# Altium schematic sheet SAMD51.SchDoc
size A3
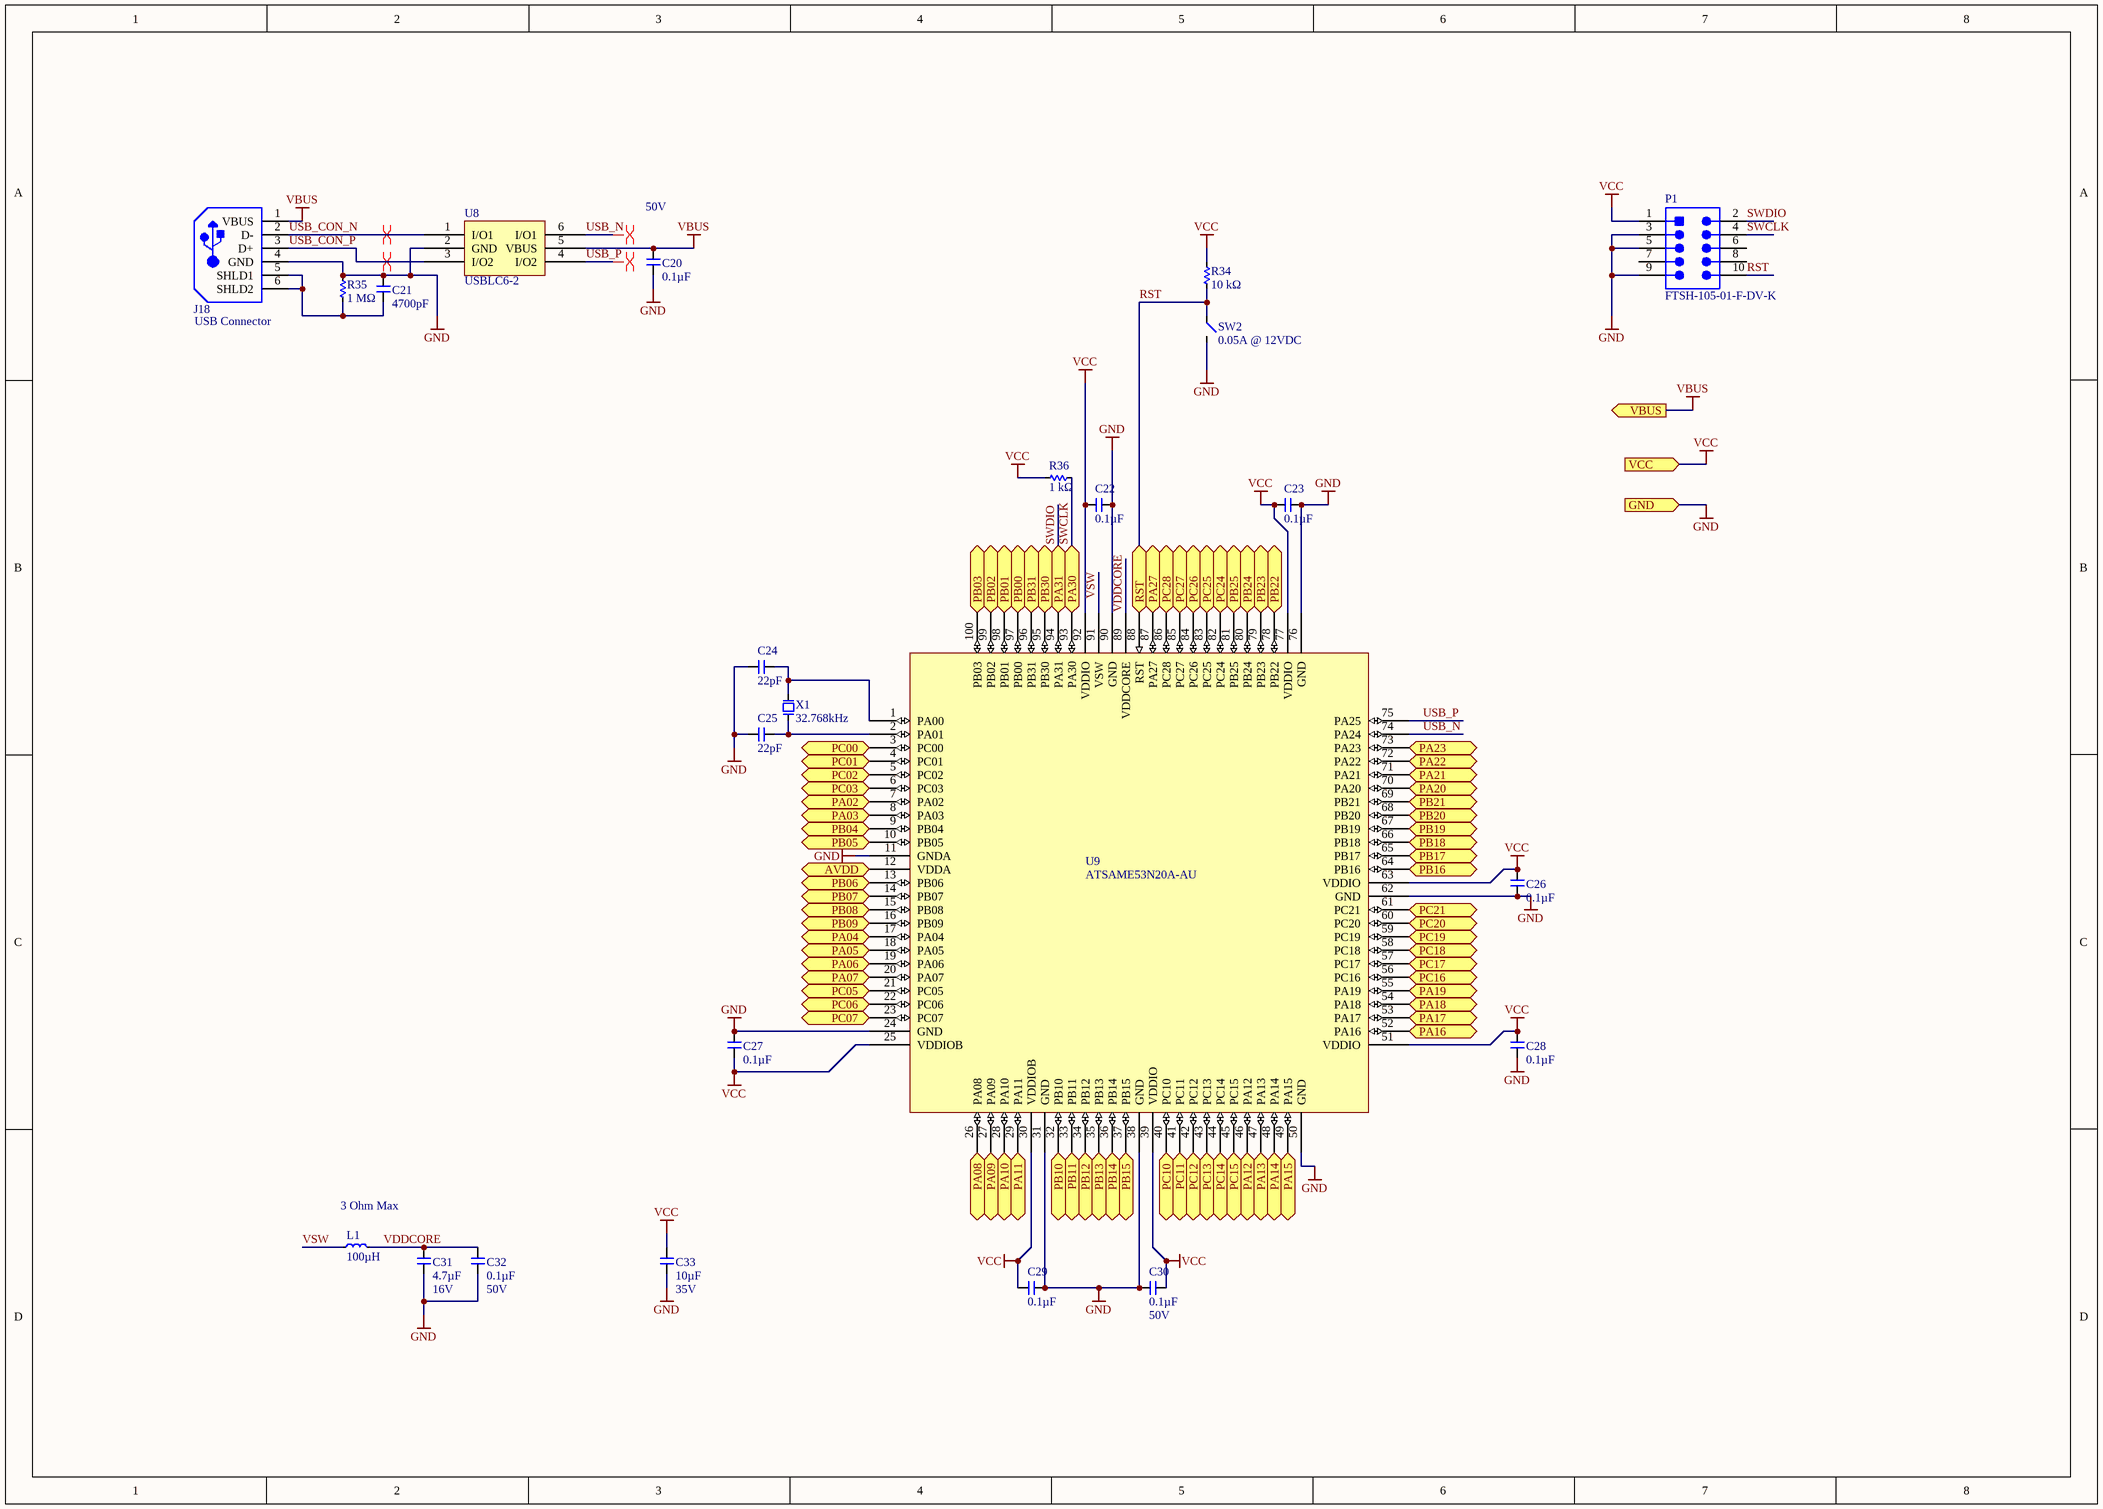
[diagram p0: SAMD51.SchDoc]

## Parts
C20  Capacitance (shorthand): 0.1µF  Rated Voltage: 50V  [C0603]  (hidden comment: 490-1519-1-ND)
C21  Capacitance (shorthand): 4700pF  [C0603]  (hidden comment: 490-1506-1-ND)
C22  Capacitance (shorthand): 0.1µF  [C0603]  (hidden comment: 490-1519-1-ND)
C23  Capacitance (shorthand): 0.1µF  [C0603]  (hidden comment: 490-1519-1-ND)
C24  Capacitance (shorthand): 22pF  [C0603]  (hidden comment: 490-1411-1-ND)
C25  Capacitance (shorthand): 22pF  [C0603]  (hidden comment: 490-1411-1-ND)
C26  Capacitance (shorthand): 0.1µF  [C0603]  (hidden comment: 490-1519-1-ND)
C27  Capacitance (shorthand): 0.1µF  [C0603]  (hidden comment: 490-1519-1-ND)
C28  Capacitance (shorthand): 0.1µF  [C0603]  (hidden comment: 490-1519-1-ND)
C29  Capacitance (shorthand): 0.1µF  [C0603]  (hidden comment: 490-1519-1-ND)
C30  Capacitance (shorthand): 0.1µF  Rated Voltage: 50V  [C0603]  (hidden comment: 490-1519-1-ND)
C31  Capacitance (shorthand): 4.7µF  Rated Voltage: 16V  [C0603]  (hidden comment: 311-1785-1-ND)
C32  Capacitance (shorthand): 0.1µF  Rated Voltage: 50V  [C0603]  (hidden comment: 490-1519-1-ND)
C33  Capacitance (shorthand): 10µF  Rated Voltage: 35V  [C0603]  (hidden comment: 490-13248-1-ND)
J18  USBR-B-S-S-O-TH  [SMTC-USBR-TH-4_V]  (value not drawn)
L1  DC Resistance (DCR): 3 Ohm Max  Inductance: 100µH  [C1210]  (hidden comment: IND_BRL3225T101K)
P1  FTSH-105-01-F-DV-K  [SMTC-FTSH-105-01-L-DV-K_V]
R34  Resistance: 10 kΩ  [R0603]  (hidden comment: 311-10.0KHRCT-ND)
R35  Resistance: 1 MΩ  [R0603]  (hidden comment: 311-1.00MHRCT-ND)
R36  Resistance: 1 kΩ  [R0603]  (hidden comment: 311-1.00KHRCT-ND)
SW2  Contact Rating @ Voltage: 0.05A @ 12VDC  [SWITCH_FSM4JSMATR]  (hidden comment: SWITCH_FSM4JSMATR)
U8  USBLC6-2  [6SOT23]
U9  ATSAME53N20A-AU  [TSQFP50P1600X1600X120-100N]
X1  Frequency: 32.768kHz  [XTAL_TXC_9HT10]  (hidden comment: XTAL_9HT10-32.768KEZF-T)

## Ports
AVDD (bidir), GND (in), PA02 (bidir), PA03 (bidir), PA04 (bidir), PA05 (bidir), PA06 (bidir), PA07 (bidir), PA08 (bidir), PA09 (bidir), PA10 (bidir), PA11 (bidir), PA12 (bidir), PA13 (bidir), PA14 (bidir), PA15 (bidir), PA16 (bidir), PA17 (bidir), PA18 (bidir), PA19 (bidir), PA20 (bidir), PA21 (bidir), PA22 (bidir), PA23 (bidir), PA27 (bidir), PA30 (bidir), PA31 (bidir), PB00 (bidir), PB01 (bidir), PB02 (bidir), PB03 (bidir), PB04 (bidir), PB05 (bidir), PB06 (bidir), PB07 (bidir), PB08 (bidir), PB09 (bidir), PB10 (bidir), PB11 (bidir), PB12 (bidir), PB13 (bidir), PB14 (bidir), PB15 (bidir), PB16 (bidir), PB17 (bidir), PB18 (bidir), PB19 (bidir), PB20 (bidir), PB21 (bidir), PB22 (bidir), PB23 (bidir), PB24 (bidir), PB25 (bidir), PB30 (bidir), PB31 (bidir), PC00 (bidir), PC01 (bidir), PC02 (bidir), PC03 (bidir), PC05 (bidir), PC06 (bidir), PC07 (bidir), PC10 (bidir), PC11 (bidir), PC12 (bidir), PC13 (bidir), PC14 (bidir), PC15 (bidir), PC16 (bidir), PC17 (bidir), PC18 (bidir), PC19 (bidir), PC20 (bidir), PC21 (bidir), PC24 (bidir), PC25 (bidir), PC26 (bidir), PC27 (bidir), PC28 (bidir), RST (bidir), VBUS (out), VCC (in)

## Nets
GND: C20.2 C21.1 C22.1 C23.1 C24.1 C25.1 C26.1 C27.1 C28.1 C29.2 C30.2 C31.1 C32.2 C33.1 J18.4(GND) P1.3 P1.5 P1.9 R35.2 SW2.2 U8.2(GND) U9.11(GNDA) U9.24(GND) U9.31(GND) U9.38(GND) U9.50(GND) U9.62(GND) U9.76(GND) U9.90(GND) ; port GND
VBUS: C20.1 J18.1(VBUS) U8.5(VBUS) ; port VBUS
VCC: C22.2 C23.2 C26.2 C27.2 C28.2 C29.1 C30.1 C33.2 P1.1 R34.1 R36.2 U9.25(VDDIOB) U9.30(VDDIOB) U9.39(VDDIO) U9.51(VDDIO) U9.63(VDDIO) U9.77(VDDIO) U9.92(VDDIO) ; port VCC
AVDD: U9.12(VDDA) ; port AVDD
PA02: U9.7(PA02) ; port PA02
PA03: U9.8(PA03) ; port PA03
PA04: U9.17(PA04) ; port PA04
PA05: U9.18(PA05) ; port PA05
PA06: U9.19(PA06) ; port PA06
PA07: U9.20(PA07) ; port PA07
PA08: U9.26(PA08) ; port PA08
PA09: U9.27(PA09) ; port PA09
PA10: U9.28(PA10) ; port PA10
PA11: U9.29(PA11) ; port PA11
PA12: U9.46(PA12) ; port PA12
PA13: U9.47(PA13) ; port PA13
PA14: U9.48(PA14) ; port PA14
PA15: U9.49(PA15) ; port PA15
PA16: U9.52(PA16) ; port PA16
PA17: U9.53(PA17) ; port PA17
PA18: U9.54(PA18) ; port PA18
PA19: U9.55(PA19) ; port PA19
PA20: U9.70(PA20) ; port PA20
PA21: U9.71(PA21) ; port PA21
PA22: U9.72(PA22) ; port PA22
PA23: U9.73(PA23) ; port PA23
PA27: U9.87(PA27) ; port PA27
PB00: U9.97(PB00) ; port PB00
PB01: U9.98(PB01) ; port PB01
PB02: U9.99(PB02) ; port PB02
PB03: U9.100(PB03) ; port PB03
PB04: U9.9(PB04) ; port PB04
PB05: U9.10(PB05) ; port PB05
PB06: U9.13(PB06) ; port PB06
PB07: U9.14(PB07) ; port PB07
PB08: U9.15(PB08) ; port PB08
PB09: U9.16(PB09) ; port PB09
PB10: U9.32(PB10) ; port PB10
PB11: U9.33(PB11) ; port PB11
PB12: U9.34(PB12) ; port PB12
PB13: U9.35(PB13) ; port PB13
PB14: U9.36(PB14) ; port PB14
PB15: U9.37(PB15) ; port PB15
PB16: U9.64(PB16) ; port PB16
PB17: U9.65(PB17) ; port PB17
PB18: U9.66(PB18) ; port PB18
PB19: U9.67(PB19) ; port PB19
PB20: U9.68(PB20) ; port PB20
PB21: U9.69(PB21) ; port PB21
PB22: U9.78(PB22) ; port PB22
PB23: U9.79(PB23) ; port PB23
PB24: U9.80(PB24) ; port PB24
PB25: U9.81(PB25) ; port PB25
PB30: U9.95(PB30) ; port PB30
PB31: U9.96(PB31) ; port PB31
PC00: U9.3(PC00) ; port PC00
PC01: U9.4(PC01) ; port PC01
PC02: U9.5(PC02) ; port PC02
PC03: U9.6(PC03) ; port PC03
PC05: U9.21(PC05) ; port PC05
PC06: U9.22(PC06) ; port PC06
PC07: U9.23(PC07) ; port PC07
PC10: U9.40(PC10) ; port PC10
PC11: U9.41(PC11) ; port PC11
PC12: U9.42(PC12) ; port PC12
PC13: U9.43(PC13) ; port PC13
PC14: U9.44(PC14) ; port PC14
PC15: U9.45(PC15) ; port PC15
PC16: U9.56(PC16) ; port PC16
PC17: U9.57(PC17) ; port PC17
PC18: U9.58(PC18) ; port PC18
PC19: U9.59(PC19) ; port PC19
PC20: U9.60(PC20) ; port PC20
PC21: U9.61(PC21) ; port PC21
PC24: U9.82(PC24) ; port PC24
PC25: U9.83(PC25) ; port PC25
PC26: U9.84(PC26) ; port PC26
PC27: U9.85(PC27) ; port PC27
PC28: U9.86(PC28) ; port PC28
RST: P1.10 R34.2 SW2.1 U9.88(RST) ; port RST
SWCLK: P1.4 R36.1 U9.93(PA30) ; port PA30
SWDIO: P1.2 U9.94(PA31) ; port PA31
USB_CON_N: J18.2(D-) U8.1(I/O1)
USB_CON_P: J18.3(D+) U8.3(I/O2)
USB_N: U8.6(I/O1) U9.74(PA24)
USB_P: U8.4(I/O2) U9.75(PA25)
VDDCORE: C31.2 C32.1 L1.1 U9.89(VDDCORE)
VSW: L1.2 U9.91(VSW)
NetC21_2: C21.2 J18.5(SHLD1) J18.6(SHLD2) R35.1
NetC24_2: C24.2 U9.1(PA00) X1.2
NetC25_2: C25.2 U9.2(PA01) X1.1

Not connected (* = marked no-connect by the designer): P1 6 7 8

## Layout directives
differential pair: USB_CON_N, USB_CON_P, USB_N, USB_P

## Notes on the sheet
- (near J18) USB Connector
- Title
- Size:
- Date:
- A4
- Number:
- Time:
- Revision:
- Sheet
- of
- File:

## Library data of the parts
C20 C22 C23 C26-C30 C32 = CMP-119-0065-1: CAP CER 0603 0.1µF X7R 50V 10%; Manufacturer: Murata Electronics North America; Capacitance - pF (Machine readable): #NAME?; Dielectric: X7R
  C22 C23 C26-C29: Rated Voltage: 50V
C21 = CMP-119-0049-1: CAP CER 0603 4700pF X7R 50V 10%; Manufacturer: Murata Electronics North America; Capacitance - pF (Machine readable): #NAME?; Dielectric: X7R; Rated Voltage: 50V
C24 C25 = CMP-119-0008-1: CAP CER 22PF 50V C0G/NP0 0603; Manufacturer: Murata Electronics North America; Capacitance - pF (Machine readable): 22; Dielectric: C0G, NP0; Rated Voltage: 50V
C31 = CMP-119-0070-1: CAP CER 4.7UF 16V X5R 0603 10%; Manufacturer: Yageo; Capacitance - pF (Machine readable): #NAME?; Dielectric: X5R
C33 = CMP-119-0071-1: CAP CER 10UF 35V X5R 0603 20%; Manufacturer: Murata Electronics North America; Capacitance - pF (Machine readable): #NAME?; Dielectric: X5R
J18 = CMP-00011-3: Conn USB F 4 POS 2.5mm Solder RA Thru-Hole 4 Terminal 1 Port Tray; Max Voltage Rating (AC): 30V; USB Standard: USB 2.0; Number of Contacts: 4; Gender: Receptacle; Number of Ports: 1; Contact Plating: Gold; REACH SVHC: No SVHC; Radiation Hardening: No; Mount: Through Hole,Horizontal; Packaging: Tray; Length: 14.9mm; Max Operating Temperature: 85°C; Termination: Solder; Depth: 16.5mm; Connector Type: USB; Contact Material: Bronze; Pitch: 2.5mm; Series: -; Number of Terminals/Pins: 4; Orientation: Right Angle; Package Quantity: 1; Min Operating Temperature: -50°C; Housing Material: Thermoplastic
L1 = CMP-052-0010-1: INDUCTOR 100UH 270MA 1210 SMD; Manufacturer: Taiyo Yuden; Current - Temperature Rise: 250mA; Tolerance: ±10%; Shielding: Unshielded; Frequency - Self Resonant: 5MHz; Frequency - Test: 100kHz; Manufacturer Part Number: BRL3225T101K; RoHS: RoHS Compliant; Current - Saturation: 270mA; Q @ Freq: -; Applications: Power Supplies; Material - Core: -; Package / Case: 1210 (3225 Metric); Mounting Type: Surface Mount; Packaging: Cut Tape (CT); Operating Temperature: -40°C ~ 105°C; ComponentLink1URL: http://www.yuden.co.jp/ut/product/pdf/wound07_e.pdf; ComponentLink1Description: Datasheet; Current: 270mA; Stock 1: 84687; Source: inductor.SchLib; Pricing 1: 1=0.16, 10=0.155, 50=0.145, 100=0.1354, 500=0.10638, 1000=0.08704 (GBP); Design Item ID: IND_BRL3225T101K
P1 = CMP-2000-05352-1: Male Header, Pitch 1.27 mm, 2 x 5 Position, Height 6.12 mm, RoHS, Tube; Manufacturer: Samtec; Number of Positions: 10; Connector Type: Header,Shrouded; Number of Positions Loaded: All; Row Spacing: 0.050"(1.27mm); Fastening Type: -; Package Reference: FTSH-105-01-L-DV-K; Termination: Solder; Package URL: http://suddendocs.samtec.com/prints/ftsh-1xx-xx-xxx-dv-xxx-footprint.pdf; Number of Rows: 2; Contact Finish Thickness: 3µin(0.08µm); Contact Type: MalePin; Manufacturer URL: http://www.samtec.com/; Series: FTSH; Features: -; Contact Finish: Gold; Color: Black; Family: RectangularConnectors-Headers,MalePins; Datasheet URL: http://suddendocs.samtec.com/prints/ftsh-1xx-xx-xxx-dv-xxx-mkt.pdf; Package Description: Male Header, Pitch 1.27 mm, 2 x 5 Position, Height 5.97 mm, Tail Length 4.32 mm; Mounting Type: SurfaceMount; Datasheet Version: Rev. ET, 10/1995; Category: Connectors,Interconnects; Packaging: Tube; Contact Mating Length: 0.120"(3.05mm); Pitch: 0.050"(1.27mm)
R34 = CMP-126-0273-2: RES SMD 10K OHM 1% 1/10W 0603; Manufacturer Part Number: RC0603FR-0710KL; Manufacturer: Yageo; Resistance (Sortable): 10000; Power (Watts): 0.1W, 1/10W; Temperature Coefficient: ±100ppm/°C; Datasheets: http://www.yageo.com/documents/recent/PYu-RC_Group_51_RoHS_L_9.pdf; Image: //media.digikey.com/Renders/Yageo%20Renders/0603-(1608-Metric).jpg; Tolerance: ±1%; Operating Temperature: -55°C ~ 155°C
R35 = CMP-126-0484-2: RES SMD 1M OHM 1% 1/10W 0603; Manufacturer Part Number: RC0603FR-071ML; Manufacturer: Yageo; Resistance (Sortable): 1000000; Power (Watts): 0.1W, 1/10W; Temperature Coefficient: ±100ppm/°C; Datasheets: http://www.yageo.com/documents/recent/PYu-RC_Group_51_RoHS_L_9.pdf; Image: //media.digikey.com/Renders/Yageo%20Renders/0603-(1608-Metric).jpg; Tolerance: ±1%; Operating Temperature: -55°C ~ 155°C
R36 = CMP-126-0172-2: RES SMD 1K OHM 1% 1/10W 0603; Manufacturer Part Number: RC0603FR-071KL; Manufacturer: Yageo; Resistance (Sortable): 1000; Power (Watts): 0.1W, 1/10W; Temperature Coefficient: ±100ppm/°C; Datasheets: http://www.yageo.com/documents/recent/PYu-RC_Group_51_RoHS_L_9.pdf; Image: //media.digikey.com/Renders/Yageo%20Renders/0603-(1608-Metric).jpg; Tolerance: ±1%; Operating Temperature: -55°C ~ 155°C
SW2 = CMP-062-0009-1: SWITCH TACTILE SPST-NO 0.05A 12V; Manufacturer: TE Connectivity; Switch Function: Off-Mom; Actuator Type: Standard; Actuator Height off PCB, from Pins: 5.00mm; Actuator Orientation: Top Actuated; Outline: 6.00mm x 6.00mm; Illumination: Non-Illuminated; Operating Force: 160gf; Actuator Material: Polyphenylene Sulfide (PPS); Switch Travel: 0.25mm; Mechanical Life: 100,000 Cycles; Manufacturer Part Number: FSM4JSMATR; RoHS: RoHS Compliant; Stock 1: 24144; Pricing 1: 1=0.36, 10=0.34, 25=0.2912, 50=0.2474, 100=0.2377, 250=0.21344, 500=0.20374 (USD); Circuit: SPST-NO; Mounting Type: Surface Mount; Termination Style: Gull Wing; Illumination Voltage (Nominal): -; Illumination Type, Color: -; Ingress Protection: -; Features: -; Packaging: Cut Tape (CT); Operating Temperature: -35°C ~ 85°C; ComponentLink1URL: http://www.te.com/commerce/DocumentDelivery/DDEController?Action=srchrtrv&DocNm=2-1437565-7&DocType=Customer+Drawing&DocLang=English; ComponentLink1Description: Datasheet; Source: miscellaneous.SchLib; Design Item ID: SWITCH_FSM4JSMATR
U8 = CMP-038-0001-1: Manufacturer: STMicroelectronics; Manufacturer Part Number: USBLC6-2SC6; Unidirectional Channels: 2; Voltage - Reverse Standoff (Typ): 5.25V; Voltage - Breakdown (Min): 6V; Voltage - Clamping (Max) @ Ipp: 17V; Current - Peak Pulse (10/1000µs): 5A (8/20µs); Power Line Protection: Yes; RoHS: RoHS Compliant; Stock 1: 31719; Pricing 1: 1=0.51, 10=0.411, 100=0.2802, 500=0.21012, 1000=0.15759 (USD); Packaging: Cut Tape (CT); Part Status: Active; Bidirectional Channels: -; Power - Peak Pulse: -; Applications: Ethernet; Capacitance @ Frequency: -; Operating Temperature: -40°C ~ 125°C (TJ); Mounting Type: Surface Mount; Package / Case: SOT-23-6; Supplier Device Package: SOT-23-6; ComponentLink1URL: http://www.st.com/web/en/resource/technical/document/datasheet/CD00050750.pdf; ComponentLink1Description: http://www.st.com/web/en/resource/technical/document/datasheet/CD00050750.pdf; Design Item ID: USBLC6-2; Source: ic_analog.SchLib
U9 = CMP-025-0003-5: MCU 32-bit ARM Cortex M4F RISC 1MB Flash 3.3V 100-Pin TQFP Tray
X1 = CMP-066-0008-1: CRYSTAL 32.768 KHZ 12.5 PF SMD; Manufacturer: TXC CORPORATION; Frequency Tolerance: ±10ppm; ESR (Equivalent Series Resistance): 70 kOhm; Operating Mode: Fundamental; Load Capacitance: 12.5pF; Manufacturer Part Number: 9HT10-32.768KEZF-T; RoHS: RoHS Compliant; Stock 1: 5250; Pricing 1: 1=1.88, 10=1.625, 50=1.425, 100=1.125, 500=0.95, 1000=0.75 (USD); Frequency Stability: -; Operating Temperature: -40°C ~ 85°C; Ratings: -; Mounting Type: Surface Mount; Package / Case: 2-SMD; Size / Dimension: 0.126" L x 0.059" W (3.20mm x 1.50mm); Height: 0.033" (0.85mm); Packaging: Cut Tape (CT); ComponentLink1URL: http://www.txccrystal.com/images/pdf/9ht10.pdf; ComponentLink1Description: Datasheet; Design Item ID: XTAL_9HT10-32.768KEZF-T; Source: oscillator.SchLib